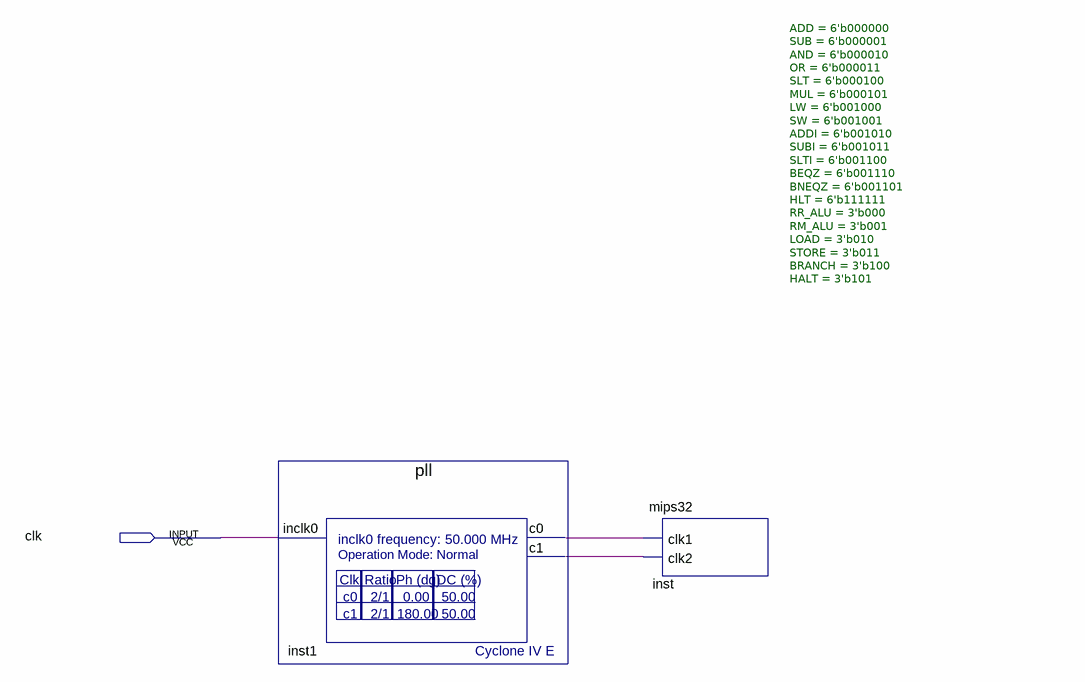
[diagram p0: schematic sheet]
// Quartus schematic mips321.bdf as structural Verilog: 2 symbols, 1 pins
module mips321 (
  input  clk
);

  wire inst1_c0, inst1_c1;

  pll inst1 (.inclk0(clk), .c0(inst1_c0), .c1(inst1_c1));
  mips32 #(.ADD(6'b000000), .SUB(6'b000001), .AND(6'b000010), .OR(6'b000011), .SLT(6'b000100), .MUL(6'b000101), .LW(6'b001000), .SW(6'b001001), .ADDI(6'b001010), .SUBI(6'b001011), .SLTI(6'b001100), .BEQZ(6'b001110), .BNEQZ(6'b001101), .HLT(6'b111111), .RR_ALU(3'b000), .RM_ALU(3'b001), .LOAD(3'b010), .STORE(3'b011), .BRANCH(3'b100), .HALT(3'b101)) inst (
    .clk1(inst1_c0), .clk2(inst1_c1));
endmodule
